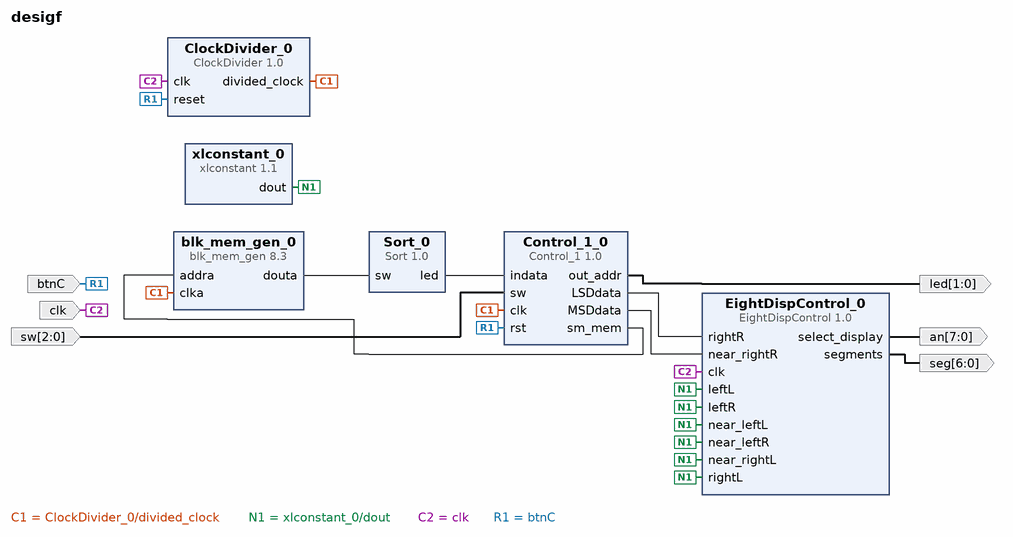
[diagram p0: block diagram of the top level]
# Vivado block design desigf, xc7a100tcsg324-1, Vivado 2016.4
create_bd_design desigf

create_bd_port -dir O -from 1 -to 0 led
create_bd_port -dir O -from 7 -to 0 an
create_bd_port -dir O -from 6 -to 0 seg
create_bd_port -dir I btnC
create_bd_port -dir I clk
create_bd_port -dir I -from 2 -to 0 sw

create_bd_cell -type ip -vlnv xilinx.com:user:ClockDivider:1.0 ClockDivider_0
create_bd_cell -type ip -vlnv ua.pt:user:EightDispControl:1.0 EightDispControl_0
create_bd_cell -type ip -vlnv xilinx.com:user:Control_1:1.0 Control_1_0
create_bd_cell -type ip -vlnv xilinx.com:ip:blk_mem_gen:8.3 blk_mem_gen_0
set_property -dict [list \
  CONFIG.Memory_Type Single_Port_ROM \
  CONFIG.Enable_32bit_Address false \
  CONFIG.Write_Width_A 32 \
  CONFIG.Enable_A Always_Enabled \
  CONFIG.Register_PortA_Output_of_Memory_Primitives false \
  CONFIG.Load_Init_File true \
  CONFIG.Coe_File ../../../../../../../coe_Exam.coe \
  CONFIG.Use_RSTA_Pin false \
  CONFIG.Port_A_Write_Rate 0 \
  CONFIG.use_bram_block Stand_Alone \
] [get_bd_cells blk_mem_gen_0]
create_bd_cell -type ip -vlnv xilinx.com:ip:xlconstant:1.1 xlconstant_0
set_property -dict {CONFIG.CONST_WIDTH 4} [get_bd_cells xlconstant_0]
create_bd_cell -type ip -vlnv xilinx.com:user:Sort:1.0 Sort_0

# ---- connections ----

connect_bd_net [get_bd_pins Control_1_0/LSDdata] [get_bd_pins EightDispControl_0/rightR]
connect_bd_net [get_bd_pins Control_1_0/MSDdata] [get_bd_pins EightDispControl_0/near_rightR]
connect_bd_net [get_bd_pins Control_1_0/out_addr] [get_bd_ports led]
connect_bd_net [get_bd_ports sw] [get_bd_pins Control_1_0/sw]
connect_bd_net [get_bd_pins ClockDivider_0/divided_clock] [get_bd_pins Control_1_0/clk] [get_bd_pins blk_mem_gen_0/clka]
connect_bd_net [get_bd_pins Control_1_0/sm_mem] [get_bd_pins blk_mem_gen_0/addra]
connect_bd_net [get_bd_pins blk_mem_gen_0/douta] [get_bd_pins Sort_0/sw]
connect_bd_net [get_bd_pins Sort_0/led] [get_bd_pins Control_1_0/indata]
connect_bd_net [get_bd_pins xlconstant_0/dout] \
  [get_bd_pins EightDispControl_0/near_leftL] [get_bd_pins EightDispControl_0/leftL] \
  [get_bd_pins EightDispControl_0/near_rightL] [get_bd_pins EightDispControl_0/rightL] [get_bd_pins EightDispControl_0/leftR] \
  [get_bd_pins EightDispControl_0/near_leftR]
connect_bd_net [get_bd_pins EightDispControl_0/select_display] [get_bd_ports an]
connect_bd_net [get_bd_pins EightDispControl_0/segments] [get_bd_ports seg]
connect_bd_net [get_bd_ports clk] [get_bd_pins ClockDivider_0/clk] [get_bd_pins EightDispControl_0/clk]
connect_bd_net [get_bd_ports btnC] [get_bd_pins Control_1_0/rst] [get_bd_pins ClockDivider_0/reset]

validate_bd_design
save_bd_design
